# Altium schematic sheet 03_AI_PFI_Connector.SchDoc
size A3
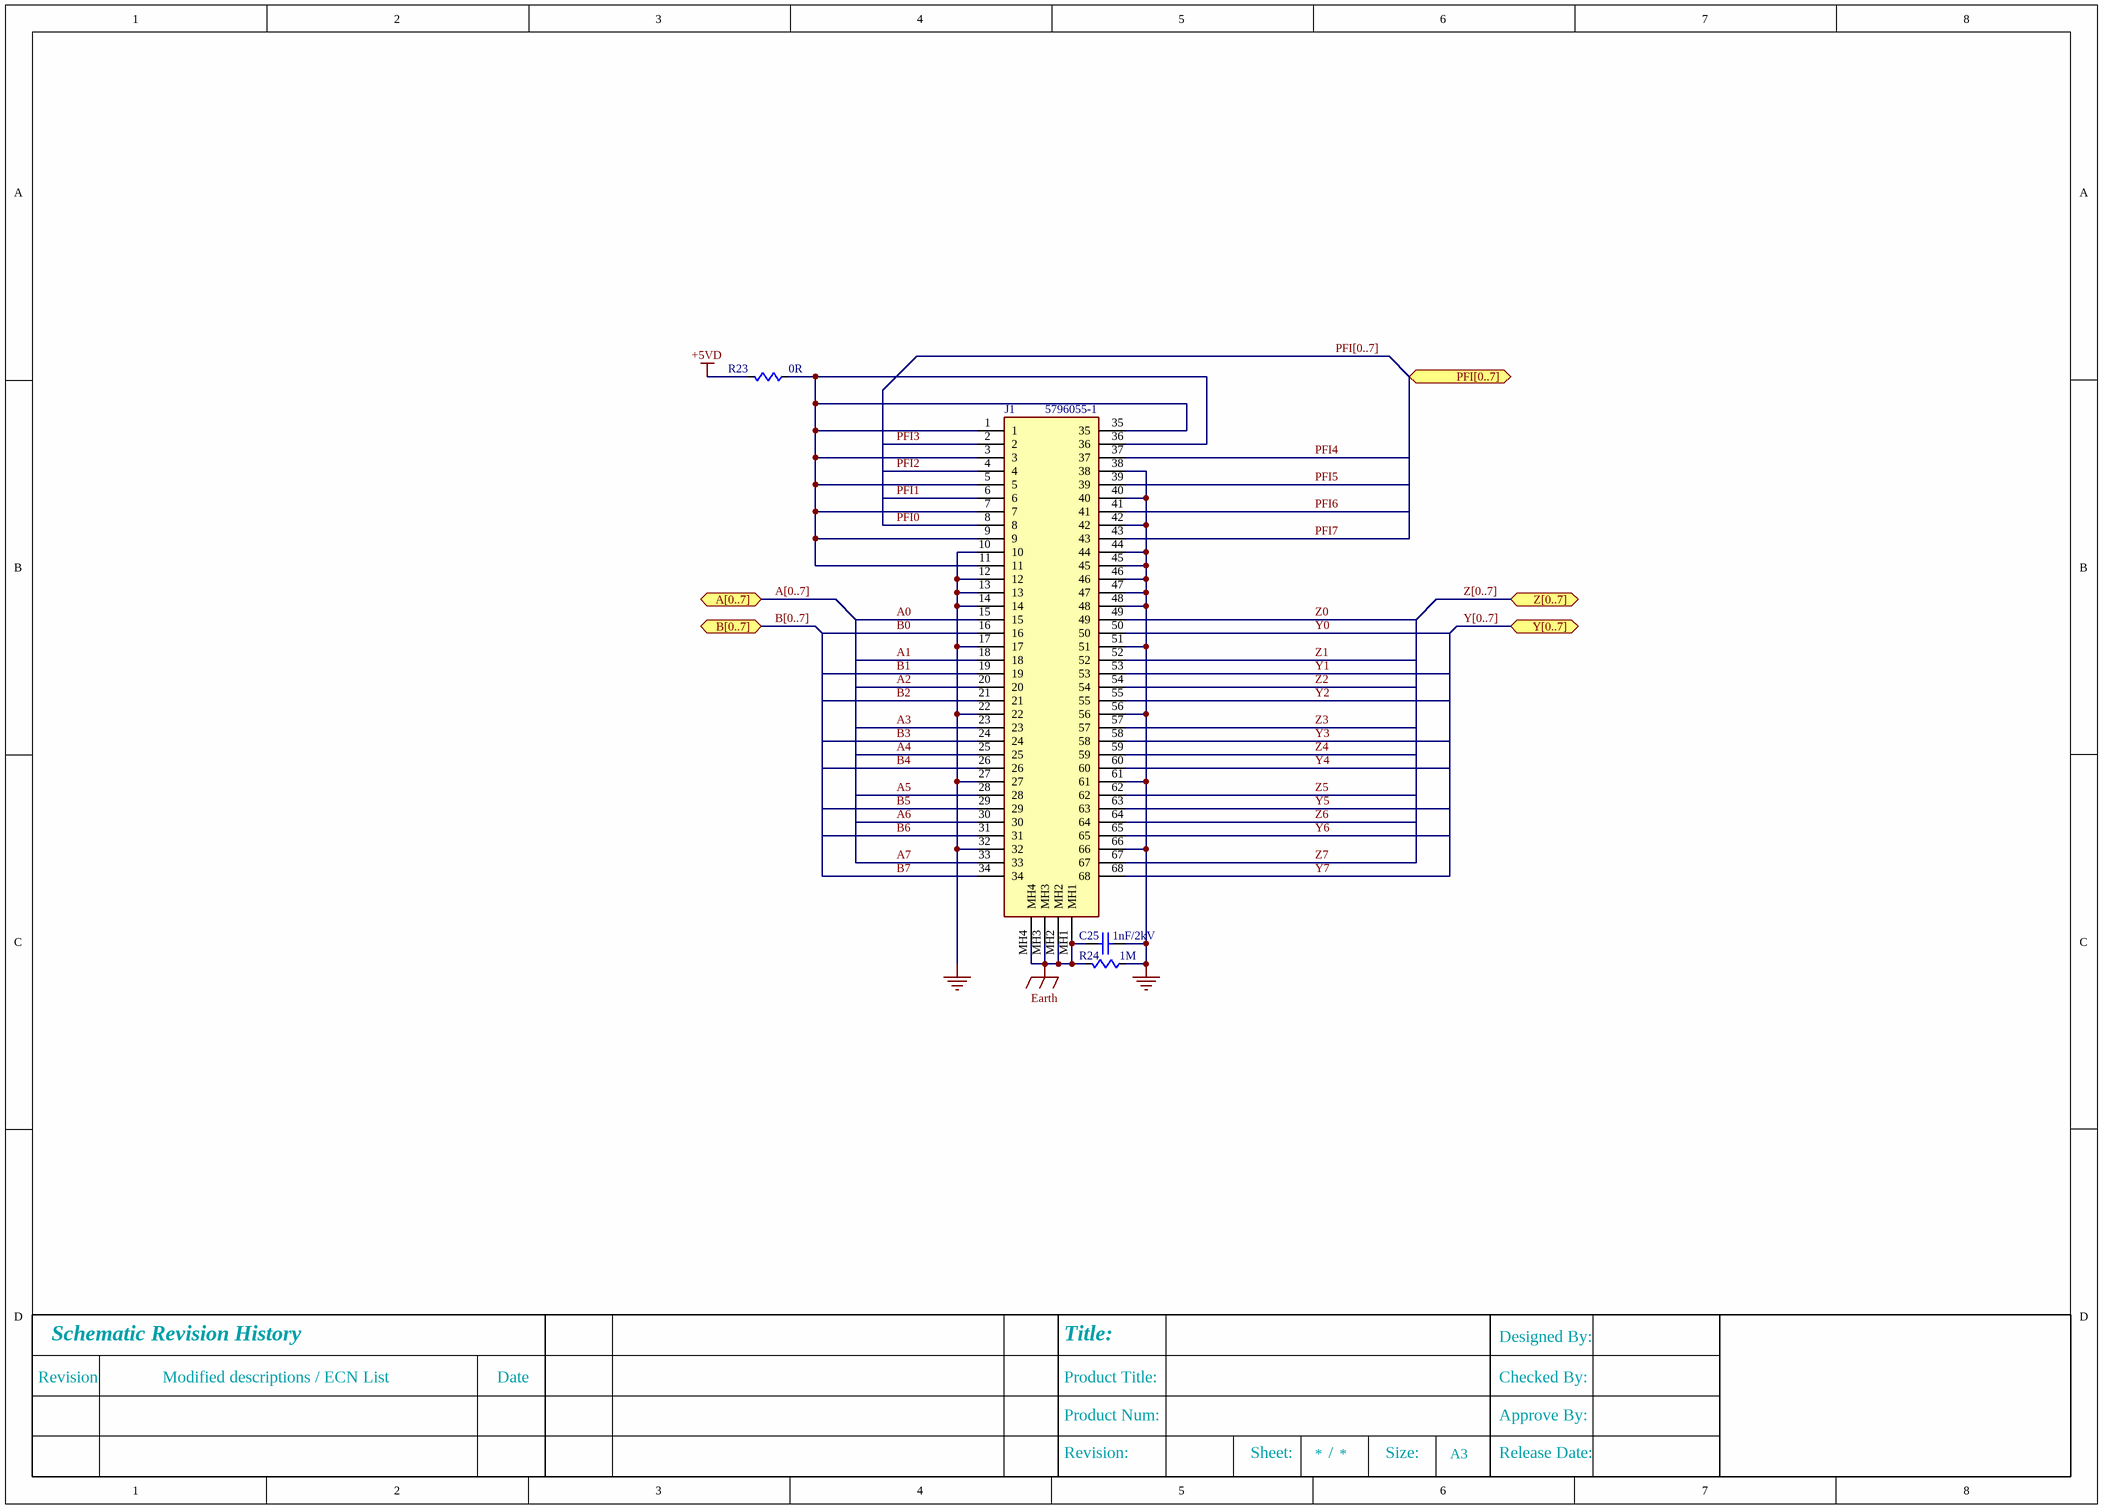
[diagram p0: 03_AI_PFI_Connector.SchDoc]

## Parts
C25  1nF/2kV  [C1206]
J1  5796055-1  [57960551]
R23  0R  [R0805]
R24  1M  [R1206]

## Ports
A[0..7] (bidir), B[0..7] (bidir), PFI[0..7] (bidir), Y[0..7] (bidir), Z[0..7] (bidir)

## Nets
+5VD: R23.2
Earth: C25.1 J1.MH1 J1.MH2 J1.MH3 J1.MH4 R24.1
GND: C25.2 J1.10 J1.12 J1.13 J1.14 J1.17 J1.22 J1.27 J1.32 J1.38 J1.40 J1.42 J1.44 J1.45 J1.46 J1.47 J1.48 J1.51 J1.56 J1.61 J1.66 R24.2
A0: J1.15
A1: J1.18
A2: J1.20
A3: J1.23
A4: J1.25
A5: J1.28
A6: J1.30
A7: J1.33
B0: J1.16
B1: J1.19
B2: J1.21
B3: J1.24
B4: J1.26
B5: J1.29
B6: J1.31
B7: J1.34
PFI0: J1.8
PFI1: J1.6
PFI2: J1.4
PFI3: J1.2
PFI4: J1.37
PFI5: J1.39
PFI6: J1.41
PFI7: J1.43
Y0: J1.50
Y1: J1.53
Y2: J1.55
Y3: J1.58
Y4: J1.60
Y5: J1.63
Y6: J1.65
Y7: J1.68
Z0: J1.49
Z1: J1.52
Z2: J1.54
Z3: J1.57
Z4: J1.59
Z5: J1.62
Z6: J1.64
Z7: J1.67
NetJ1_1: J1.1 J1.3 J1.5 J1.7 J1.9 J1.11 J1.35 J1.36 R23.1

## Buses and harness runs
bus A[0..7] = port A[0..7]
bus B[0..7] = port B[0..7]
bus PFI[0..7] = port PFI[0..7]
bus Y[0..7] = port Y[0..7]
bus Z[0..7] = port Z[0..7]

## Notes on the sheet
- Revision
- Schematic Revision History
- Modified descriptions / ECN List
- Date
- Product Title:
- Title:
- Checked By:
- Designed By:
- Revision:
- Product Num:
- Sheet:
- /
- Size:
- A3
- Approve By:
- Release Date:
- Title
- Date:
- Number:
- Time:
- Sheet
- of
- File:

## Library data of the parts
C25 = C: MLCC
J1 = 5796055-1: Connector; Manufacturer_Name: TE Connectivity; Datasheet Link: https://www.te.com/commerce/DocumentDelivery/DDEController?Action=showdoc&DocId=Customer+Drawing%7F5796055%7FD1%7Fpdf%7FEnglish%7FENG_CD_5796055_D1.pdf%7F5796055-1; Height: 6.97mm; Manufacturer_Part_Number: 5796055-1; Mouser Part Number: 571-5796055-1; Mouser Price/Stock: https://www.mouser.co.uk/ProductDetail/TE-Connectivity/5796055-1?qs=PmjM%2FwY1RTotsIMTk9j%2Fug%3D%3D; Arrow Part Number: 5796055-1; Arrow Price/Stock: https://www.arrow.com/en/products/5796055-1/te-connectivity?region=nac
R23 = R: 贴片电阻
R24 = R: 贴片电阻 1206